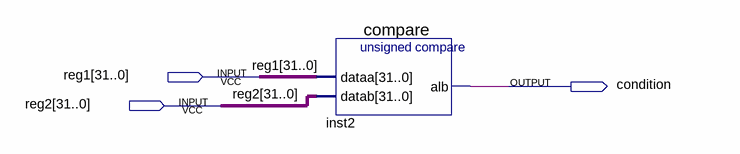
[diagram p0: schematic sheet]
// Quartus schematic blt.bdf as structural Verilog: 1 symbols, 3 pins
module blt (
  input  [31:0] reg1,
  input  [31:0] reg2,
  output condition
);

  compare inst2 (.dataa(reg1), .datab(reg2), .alb(condition));
endmodule
